# Altium schematic sheet Smart_Bracelet.SchDoc
size A4; SheetNumber: 1; SheetTotal: 3
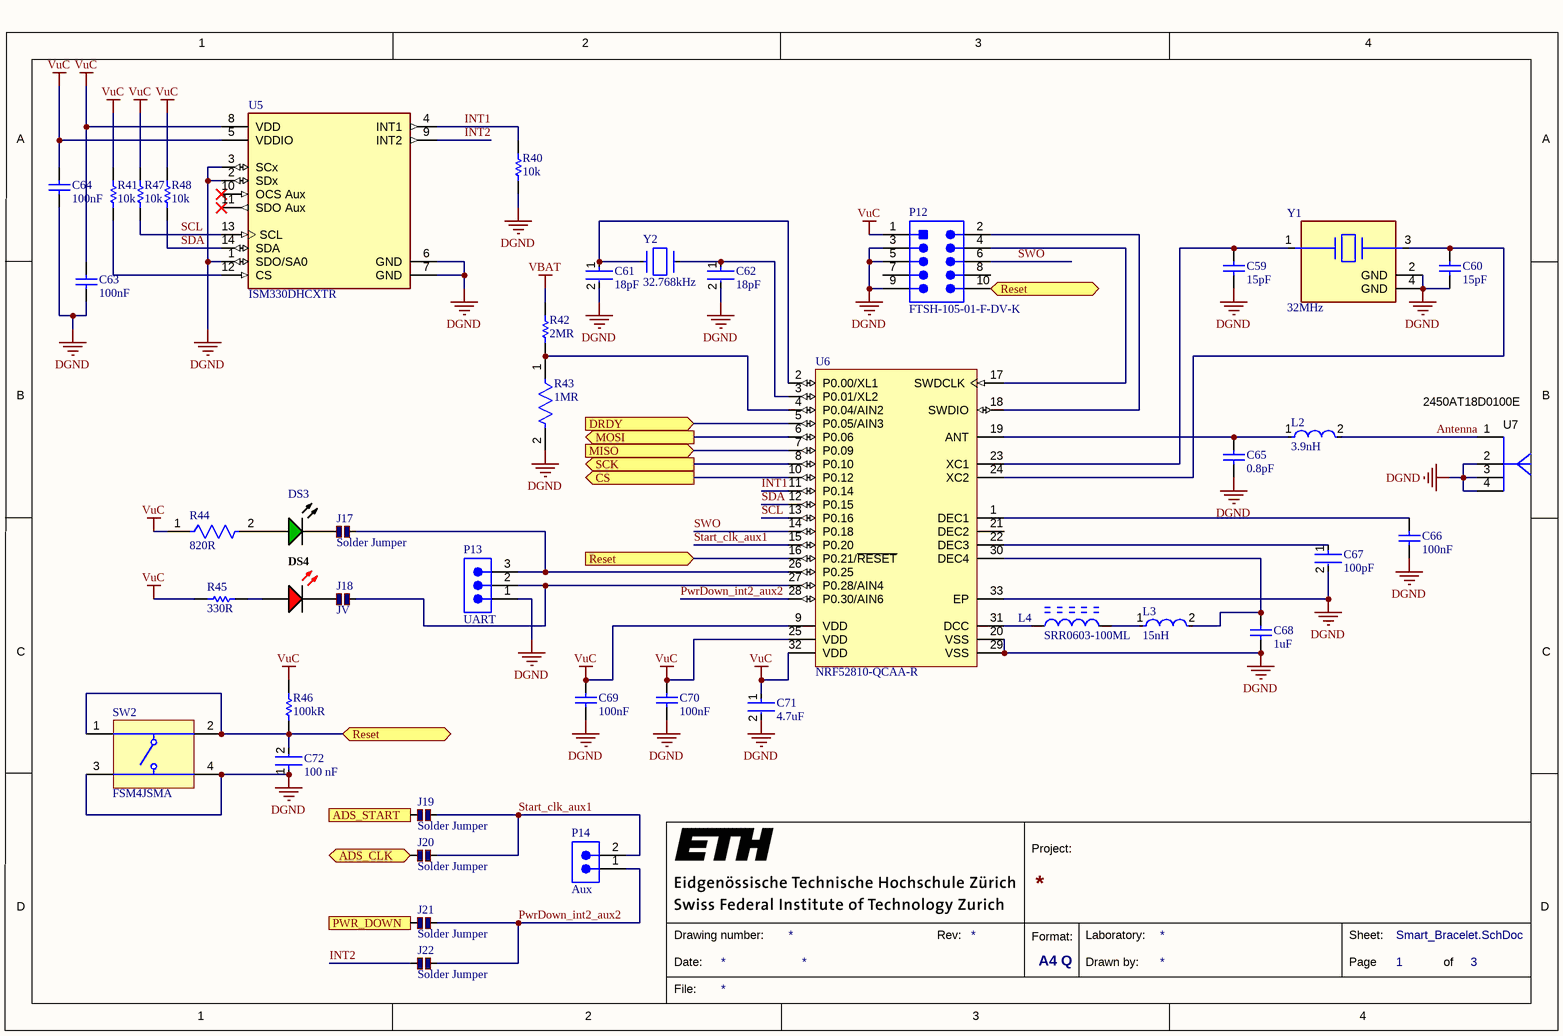
[diagram p0: Smart_Bracelet.SchDoc]

## Parts
C59  15pF  [CAPC1005X55X25ML05T10]
C60  15pF  [CAPC1005X55X25ML05T10]
C61  18pF  [FP-GJM155-0_05-IPC_A]
C62  18pF  [FP-GJM155-0_05-IPC_A]
C63  100nF  [CAPC1005X56X25ML10T15]
C64  100nF  [CAPC1005X56X25ML10T15]
C65  0.8pF  [CAPC1005X55X25ML05T10]
C66  100nF  [CAPC1005X56X25LL10T15]
C67  100pF  [FP-GCM188-0_1-IPC_B]
C68  1uF  [CAPC1608X90X35LL15T15]
C69  100nF  [CAPC1005X56X25LL10T15]
C70  100nF  [CAPC1005X56X25LL10T15]
C71  4.7uF  [FP-CC0603-DA-MFG]
C72  Capacitance: 100 nF  [FP-CC0603-DA-IPC_B]  (hidden comment: CC0603KRX7R9BB104)
DS3  APG1608CGKC/T  [KING-LED0603-25-GREEN_V]  (value not drawn)
DS4  APG1608SURKC/T  [KING-LED0603-25-RED_V]  (value not drawn)
J17  Solder Jumper  [Small Solder Jumper]
J18  JV  [Small Solder Jumper]
J19  Solder Jumper  [Small Solder Jumper]
J20  Solder Jumper  [Small Solder Jumper]
J21  Solder Jumper  [Small Solder Jumper]
J22  Solder Jumper  [Small Solder Jumper]
L2  3.9nH  [FP-LQW15AN_80-MFG]
L3  15nH  [FP-LQW15AN_80-MFG]
L4  SRR0603-100ML  [BOUR-SRR0603_V]
P12  FTSH-105-01-F-DV-K  [SMTC-FTSH-105-01-L-DV-K_V]
P13  UART  [SMTC-TSW-103-07-X-S]
P14  Aux  [SMTC-TSW-102-26-XX-S]
R40  10k  [RESC1609X50X30NL8T20]
R41  10k  [RESC1609X50X30NL8T20]
R42  2MR  [RESC0603(1608)_M]
R43  1MR  [FP-CRCW0603-e3-MFG]
R44  820R  [FP-CRCW0603-e3-IPC_B]
R45  330R  [RESC1608X55X25ML10T15]
R46  100kR  [RESC1608X55X30ML15T15]
R47  10k  [RESC1609X50X30NL8T20]
R48  10k  [RESC1609X50X30NL8T20]
SW2  FSM4JSMA  [TECO-FSM4JSMA_V]
U5  ISM330DHCXTR  [FP-LGA-14L-DM00249496-MFG]
U6  NRF52810-QCAA-R  [NRSC-QFN-32_A_L]
U7  2450AT18D0100E  [JT-2450AT18D0100E_V]
Y1  32MHz  [FP-402-MFG]
Y2  32.768kHz  [FP-ECX-34R-MFG]

## Ports
ADS_CLK (bidir), ADS_START (out), CS (out), DRDY (in), MISO (in), MOSI (out), PWR_DOWN (out), Reset (bidir), Reset (in), SCK (out)

## Nets
DGND: C59.1 C60.1 C61.2 C62.2 C63.2 C64.2 C65.1 C66.1 C67.2 C68.1 C69.1 C70.1 C71.2 C72.1 P12.3 P12.5 P12.9 P13.1 R40.2 R43.2 SW2.3 SW2.4 U5.1(SDO/SA0) U5.2(SDx) U5.3(SCx) U5.6(GND) U5.7(GND) U6.20(VSS) U6.29(VSS) U6.33(EP) U7.2(GND) U7.3(GND) U7.4(GND) Y1.2(GND) Y1.4(GND)
VBAT: R42.2
VuC: C63.1 C64.1 C69.2 C70.2 C71.1 P12.1 R41.1 R44.1 R45.1 R46.2 R47.1 R48.2 U5.5(VDDIO) U5.8(VDD) U6.9(VDD) U6.25(VDD) U6.32(VDD)
ADS_CLK: J20.2 ; port ADS_CLK
ADS_START: J19.2 ; port ADS_START
Antenna: L2.2 U7.1(Feeding_Point)
CS: U6.10(P0.12) ; port CS
DRDY: U6.5(P0.05/AIN3) ; port DRDY
INT1: R40.1 U5.4(INT1) U6.11(P0.14)
INT2: J22.2 U5.9(INT2)
MISO: U6.7(P0.09) ; port MISO
MOSI: U6.6(P0.06) ; port MOSI
PWR_DOWN: J21.2 ; port PWR_DOWN
PwrDown_int2_aux2: J21.1 J22.1 P14.1 U6.28(P0.30/AIN6)
Reset: C72.2 P12.10 R46.1 SW2.1 SW2.2 U6.16(P0.21/~{RESET}) ; port Reset
SCK: U6.8(P0.10) ; port SCK
SCL: R47.2 U5.13(SCL) U6.13(P0.16)
SDA: R48.1 U5.14(SDA) U6.12(P0.15)
Start_clk_aux1: J19.1 J20.1 P14.2 U6.15(P0.20)
SWO: P12.6 U6.14(P0.18)
NetC59_2: C59.2 U6.23(XC1) Y1.1
NetC60_2: C60.2 U6.24(XC2) Y1.3
NetC61_1: C61.1 U6.2(P0.00/XL1) Y2.1(In/Out)
NetC62_1: C62.1 U6.3(P0.01/XL2) Y2.2(Out/In)
NetC65_2: C65.2 L2.1 U6.19(ANT)
NetC66_2: C66.2 U6.1(DEC1)
NetC67_1: C67.1 U6.22(DEC3)
NetC68_2: C68.2 L3.2 U6.30(DEC4)
NetDS3_1: DS3.1(A) R44.2
NetDS3_2: DS3.2(K) J17.2
NetDS4_1: DS4.1(A) R45.2
NetDS4_2: DS4.2(K) J18.2
NetJ17_1: J17.1 P13.3 U6.26(P0.25)
NetJ18_1: J18.1 P13.2 U6.27(P0.28/AIN4)
NetL3_1: L3.1 L4.2
NetL4_1: L4.1 U6.31(DCC)
NetP12_2: P12.2 U6.18(SWDIO)
NetP12_4: P12.4 U6.17(SWDCLK)
NetR41_2: R41.2 U5.12(CS)
NetR42_1: R42.1 R43.1 U6.4(P0.04/AIN2)

Not connected (* = marked no-connect by the designer): P12 7 8; U5 10(OCS_Aux)* 11(SDO_Aux)*; U6 21(DEC2)

## Notes on the sheet
- 1
- 2
- 3
- 4
- A
- B
- C
- Project:
- D
- Date:
- Drawing number:
- Rev:
- Format:
- A4 Q
- Drawn by:
- Laboratory:
- Page
- Sheet:
- of
- File:

## Library data of the parts
C59 C60 = CMP-2008-04265-1: Part Number: GRM1555C1H150GA01D; Manufacturer: Murata
C61 C62 = CMP-2008-03806-2: Multi-Layer Ceramic Capacitor 18pF C0G  ±1% 0402 Paper T/R; Voltage Rating (DC): 50V; Case Code (Imperial): 0402; Radiation Hardening: No; Thickness: 0.022inch; Tolerance: 1%; Packaging: Tape and Reel; Case/Package: 0402; Lead Free: Lead Free; Max Operating Temperature: 125°C; Width: 0.02inch; Height: 0.5mm; Length: 1mm; Package Quantity: 10000; Voltage Rating: 50V; Dielectric: C0G; Termination: SMD/SMT; Depth: 0.5mm; Min Operating Temperature: -55°C; Mount: Surface Mount; Case Code (Metric): 1005; Capacitance: 18pF
C63 C64 C66 C69 C70 = CMP-2008-02880-1: Part Number: 0402ZD104MAT2A; Manufacturer: AVX Interconnect / Elco
C65 = CMP-2008-04116-1: Manufacturer: Murata; Part Number: GRM1555C1ER80BA01D
C67 = CMP-2006-02335-2: Ceramic Capacitor for Automotive 100pF  ±5% 100VDC C0G 0603 Paper T/R; Voltage: 100V; Capacitance: 100pF; Packaging: Tape and Reel; Termination: SMD/SMT; Package Quantity: 1; Height: 0.8mm; Width: 0.8mm; Dielectric: C0G; Mount: Surface Mount; Thickness: 0.035inch; Length: 1.6mm; Depth: 0.8mm; Max Operating Temperature: 125°C; Case Code (Imperial): 0603; Min Operating Temperature: -25°C; Radiation Hardening: No; Voltage Rating: 100V; Case Code (Metric): 1608; Voltage Rating (DC): 100V; Ratings: AEC-Q200; Tolerance: 5%; Lead Free: Lead Free; Case/Package: 0603
C68 = CMP-2006-02241-1: Part Number: C0603C105K9PACTU; Manufacturer: Kemet
C71 = CMP-1035-02782-2: CAP CER 4.7UF 6.3V X5R 0603; Manufacturer: YAGEO; Manufacturer Part Number: CC0603MRX5R5BB475; Tolerance: 0.2; Temperature Coefficient: 15%; Material: Ceramic; Voltage Rating: 6.3 V; Package: CC0603-DA; Voltage: 6.3 V; Temperature Characteristic: X5R; Automotive: No; Temperature: -55°C to +125°C; Temperature Range Low: -55°C; Value: 4.7 uF; Temperature Range High: +125°C; Digikey Description: CAP CER 4.7UF 6.3V X5R 0603; Mouser Description: Multilayer Ceramic Capacitors MLCC - SMD/SMT 4.7uF 6.3V X5R 20%; Device Class L2: Capacitors; Lead Free: Yes; Footprint Url: http://www.yageo.com/exep/pages/download/literatures/UPY-C_GEN_24.pdf; ComponentLink2URL: http://www.yageo.com/documents/recent/UPY-GPHC_X7R_6.3V-to-50V_18.pdf; Height: 0.9mm; Device Class L3: Ceramic Capacitors; ComponentLink2Description: Datasheet; RoHS: TRUE; Device Class L1: Passive Components; Octopart: https://octopart.com/cc0603mrx5r5bb475-yageo-8376541; Category: Cap; Capacitance: 4.7 uF
C72 = CMP-2100-03601-2: CAP CER 0.1UF 50V X7R 0603; Manufacturer: YAGEO; Tolerance: 0.1; Material: Ceramic; Temperature Coefficient: 15%; Value: 100 nF; Voltage Rating: 50 V; Lead Free: Yes; Height: 0.9mm; Voltage: 50 V; Automotive: No; Category: Cap; ComponentLink2Description: Datasheet; ComponentLink2URL: http://www.yageo.com/documents/recent/UPY-GPHC_X7R_6.3V-to-50V_18.pdf; Device Class L1: Passive Components; Device Class L2: Capacitors; Device Class L3: Ceramic Capacitors; Digikey Description: CAP CER 0.1UF 50V X7R 0603; Footprint Url: http://www.yageo.com/exep/pages/download/literatures/UPY-C_GEN_24.pdf; Manufacturer Part Number: CC0603KRX7R9BB104; Mouser Description: Multilayer Ceramic Capacitor, CC Series, 0.1 - F, - 10%, X7R, 50 V, 0603 [1608 Metric]; Octopart: https://octopart.com/cc0603krx7r9bb104-yageo-42244635; Package: CC0603-DA; RoHS: TRUE; Temperature: -55°C to +125°C; Temperature Characteristic: X7R; Temperature Range High: +125°C; Temperature Range Low: -55°C
DS3 = CMP-0239-00001-1: LED, SMT, 0603(1608), 0.25mm Thickness, Green; Forward Current: 30 mA; Reverse Voltage: 5 V; Power Dissipation: 78 mW; Packing: Reel; ComponentLink1Description: Manufacturer URL; ComponentLink1URL: http://www.kingbrightusa.com/; ComponentLink2URL: http://www.kingbrightusa.com/images/catalog/SPEC/APG1608CGKC-T.pdf; Mounting Technology: Surface Mount; Storage Temperature: -40 to 85 degC; DatasheetVersion: Rev. 5B, 10/2012; PartNumber: APG1608CGKC/T; PackageReference: LED0603-25-GREEN; ComponentLink2Description: Datasheet; PackageDescription: 2-Pin SMT LED, 1.6 x 0.8 mm Body, 0.25mm Thickness; PackageVersion: Rev. 5B, 10/2012
DS4 = CMP-0404-00004-1: Ultra Thin Hyper Red SMD Chip LED Lamp, 2 to 2.5 V, -40 to 85 degC, Body 1.6 x 0.8 mm, 0.28 mm Thickness, RoHS, Tape and Reel; Manufacturer: Kingbright; Dice: Hyper Red (AlGaInP); IR (Max): 10 uA; Luminous Intensity mcd @ 20 mA (Min.): 55; Lens Type: Water Clear; Viewing Angle: 120; Luminous Intensity mcd @ 20 mA (Typ.): 110; ComponentLink2Description: Datasheet; ComponentLink3URL: http://www.kingbrightusa.com/images/catalog/SPEC/APG1608SURKC-T.pdf; Packing: Tape and Reel; Mounting Technology: Surface Mount; PackageVersion: Rev. V.5A; ComponentLink1Description: Manufacturer URL; ComponentLink2URL: http://www.kingbrightusa.com/images/catalog/SPEC/APG1608SURKC-T.pdf; ComponentLink3Description: Package Specification; PackageDescription: 2-Pin SMT, Body 1.6 x 0.8 mm, 0.28mm Thickness, Red; PackageReference: LED0603-25-RED; DatasheetVersion: Rev. V.5A; Operating Temperature: -40 to 85 degC; PartNumber: APG1608SURKC/T; ComponentLink1URL: http://www.kingbrightusa.com/; Forward Voltage: 2 to 2.5 V; RoHS: TRUE
J17-J22 = CMP-00005-5: Value: 1; Technology: SMT
L2 = CMP-06042-003836-1: Wire Wound RF Inductor 3.9nH ±0.1nH 1950mA 0.03Ω 0402 (1005); Max DC Current: 1.95A; Self Resonant Frequency: 10GHz; Q Factor: 35; DC Resistance (DCR): 30mR; Test Frequency: 100MHz; Core Material: Ferrite; Shielding: Unshielded; Max Operating Temperature: 125°C; Case Code (Metric): 0402; Packaging: Tape and Reel; Resistor Type: Wirewound; Current Rating: 1.95A; Termination: SMD/SMT; Length: 0.039inch; Case Code (Imperial): 1005; Width: 0.024inch; Case/Package: 0402; Min Operating Temperature: -55°C; Inductance: 3.9nH; Height: 0.5mm; Package Quantity: 10000; Mount: Surface Mount; Height - Seated (Max): 0.024inch
L3 = CMP-06042-004948-1: Wire Wound RF Inductor for Automotive 15nH ±5% 1150mA 0.114Ω 0402 (1005); Shielding: Unshielded; Self Resonant Frequency: 5.5GHz; Current Rating: 1.15A; Core Material: Non-Magnetic; Test Frequency: 100MHz; DC Resistance (DCR): 114mR; Ratings: AEC-Q200; Inductance: 15nH; Min Operating Temperature: -55°C; Tolerance: 5%; Packaging: Cut Tape; Case/Package: 0402; Mount: Surface Mount; Case Code (Metric): 1005; Resistor Type: Wirewound; Max Operating Temperature: 125°C; Case Code (Imperial): 0402
L4 = CMP-2000-07145-1: Shielded Power Inductor, 10 uH, +/- 20%, -40 to 125 degC, 2-Pin SMD, RoHS, Tape and Reel; Manufacturer: Bourns; 3D Model: SRR0603.stp; Inductance: 10µH; Other Names: SRR0603-100MLTR / SRR0603100ML; DC Resistance (DCR): 120mOhmMax; Product Training Modules: MagneticProductOverview; Current - Saturation: 1.5A; PCN Assembly/Origin: MagneticproductsOct/2013; Frequency - Test: 1kHz; Material - Core: Ferrite; Online Catalog: SRRSeries; Current Rating: 1.1A; Frequency - Self Resonant: 25MHz; EDA / CAD Models: DownloadfromAcceleratedDesigns; Q @ Freq: 16@2.52MHz; Type: Wirewound; Manufacturer URL: http://www.bourns.com/; Mounting Technology: SurfaceMount; Datasheet URL: http://www.bourns.com/docs/Product-Datasheets/SRR0603.pdf; Standard Package: 1,000; Package Description: 2-Pin Surface Mount Device, Body 6.5 x 6.5 mm; RoHS Information: SRR0603SeriesMaterialDeclaration; Category: Inductors,Coils,Chokes; Package / Case: Nonstandard; Operating Temperature: -40°C~125°C; Series: SRR0603; Tolerance: ±20%; Height - Seated (Max): 0.130"(3.30mm); Packaging: Tape&Reel(TR); Shielding: Shielded; Family: FixedInductors; Package Reference: SRR00603; Size / Dimension: 0.256"Lx0.256"W(6.50mmx6.50mm); Datasheet Version: 09/2011; Mounting Type: SurfaceMount
P12 = CMP-2000-05352-1: Male Header, Pitch 1.27 mm, 2 x 5 Position, Height 6.12 mm, RoHS, Tube; Manufacturer: Samtec; Number of Positions: 10; Connector Type: Header,Shrouded; Number of Positions Loaded: All; Row Spacing: 0.050"(1.27mm); Fastening Type: -; Package Reference: FTSH-105-01-L-DV-K; Termination: Solder; Package URL: http://suddendocs.samtec.com/prints/ftsh-1xx-xx-xxx-dv-xxx-footprint.pdf; Number of Rows: 2; Contact Finish Thickness: 3µin(0.08µm); Contact Type: MalePin; Manufacturer URL: http://www.samtec.com/; Contact Mating Length: 0.120"(3.05mm); Pitch: 0.050"(1.27mm); Series: FTSH; Features: -; Contact Finish: Gold; Color: Black; Family: RectangularConnectors-Headers,MalePins; Datasheet URL: http://suddendocs.samtec.com/prints/ftsh-1xx-xx-xxx-dv-xxx-mkt.pdf; Package Description: Male Header, Pitch 1.27 mm, 2 x 5 Position, Height 5.97 mm, Tail Length 4.32 mm; Mounting Type: SurfaceMount; Datasheet Version: Rev. ET, 10/1995; Category: Connectors,Interconnects; Packaging: Tube
P13 = CMP-1024-00332-1: 0.025" SQ Post Header, Through-hole, Vertical, -55 to 105 degC, 2.54 mm Pitch, 3-Pin, Male, RoHS; PartNumber: TSW-103-07-T-S; Manufacturer: Samtec; Pitch: 2.54 mm; ComponentLink1URL: http://www.samtec.com; ComponentLink3URL: http://www.samtec.com/documents/webfiles/cpdf/TSW-XXX-XX-XXX-X-XX-XXX-MKT.pdf; Mounting Technology: Through-hole; RoHS: True; DatasheetVersion: F-214; PackageVersion: DM, 8/1988; Temperature Range: -55 to 105 degC; ComponentLink2Description: Datasheet; ComponentLink1Description: Manufacturer URL; Orientation: Vertical; PackageReference: TSW-103-07-X-S; ComponentLink3Description: Package Specification; ComponentLink2URL: http://www.samtec.com/documents/webfiles/pdf/TSW_TH.PDF; PackageDescription: .025[0.64] SQ. Post Terminal Strip Assembly
P14 = CMP-1024-00327-1: 0.025" SQ Post Header, Through-hole, Vertical, -55 to 125 degC, 2.54 mm Pitch, 2-Pin, Male, RoHS; PartNumber: TSW-102-26-G-S; Manufacturer: Samtec; Pitch: 2.54 mm; Orientation: Vertical; ComponentLink3Description: Package Specification; PackageReference: TSW-102-26-XX-S; Mounting Technology: Through-hole; ComponentLink2Description: Datasheet; ComponentLink1URL: http://www.samtec.com; DatasheetVersion: F-214; ComponentLink1Description: Manufacturer URL; RoHS: True; ComponentLink2URL: http://www.samtec.com/documents/webfiles/pdf/TSW_TH.PDF; ComponentLink3URL: http://www.samtec.com/documents/webfiles/cpdf/TSW-XXX-XX-XXX-X-XX-XXX-MKT.pdf; PackageDescription: .025[0.64] SQ. Post Terminal Strip Assembly; PackageVersion: DM, 8/1988; Temperature Range: -55 to 125 degC
R40 R41 R47 R48 = CMP-1666-00005-4: Chip Resistor, 10 KOhm, +/- 1%, 100 mW, -55 to 155 degC, 0603 (1608 Metric), RoHS, Tape and Reel; Manufacturer: Vishay Semiconductor; Voltage Rating: 75 V; Max Operating Temperature: 155 degC; PackageDescription: 2-Pin Surface Mount Device, Body 1.575 x 0.85 mm; ComponentLink1Description: Manufacturer URL; RoHSCompliant: true; PackageReference: 0603; REACH SVHC: Unknown; Length: 1.55 mm; DatasheetVersion: 06/2012; Packaging: Tape and Reel; Min Operating Temperature: -55 degC; Mounting Technology: Surface Mount; ComponentLink2URL: https://datasheet.ciiva.com/11809/0900766b80d98afc-11809037.pdf; Height: 0.45 mm; ComponentLink2Description: Datasheet; Package Quantity: 5000; ComponentLink1URL: http://www.vishay.com/
R42 = CMP-1012-00881-1: 2M 0.1W 1% 0603 (1608 Metric)  SMD; Case-Metric: 1608; Case-EIA: 0603; Value: 2000000.00 Ohm; Tolerance: 1 %; Power: 0.1 W; Technology: SMT
R43 = CMP-2000-03013-2: RES Thick Film, 1MΩ, 1%, 0.1W, 100ppm/°C, 0603; Max Power Dissipation: 100mW; Voltage Rating (DC): 75V; Depth: 0.85mm; Max Operating Temperature: 155°C; Length: 1.55mm; Power Rating: 100mW; Military Standard: Not; Resistance: 1MR; Features: Automotive AEC-Q200; Min Operating Temperature: -55°C; Number of Pins: 2; Mount: Surface Mount; Package Quantity: 10; Packaging: Tape and Reel; Height: 0.45mm; Radiation Hardening: No; Case Code (Metric): 1608; Temperature Coefficient: 100ppm/°C; Width: 0.85mm; Composition: Thick Film; Termination: SMD/SMT; Tolerance: 1%; Number of Terminations: 2; Lead Free: Lead Free; Contact Plating: Tin; Case/Package: 0603; Weight: 7.1E-05oz; Voltage Rating: 75V; Case Code (Imperial): 0603
R44 = CMP-2000-03598-2: RES Thick Film, 820Ω, 1%, 0.1W, 100ppm/°C, 0603; Max Power Dissipation: 100mW; Voltage Rating: 75V; Termination: SMD/SMT; Depth: 0.85mm; Radiation Hardening: No; Lead Free: Lead Free; Package Quantity: 10; Max Operating Temperature: 155°C; Power Rating: 100mW; Height: 0.45mm; Case Code (Metric): 1608; Case Code (Imperial): 0603; Case/Package: 0603; Mount: Surface Mount; Features: Automotive AEC-Q200; Composition: Thick Film; Weight: 7.1E-05oz; Contact Plating: Tin; Width: 0.033inch; Number of Terminations: 2; Tolerance: 1%; Packaging: Tape and Reel; Voltage Rating (DC): 75V; Length: 1.55mm; Resistance: 820R; Min Operating Temperature: -55°C; Military Standard: Not; Temperature Coefficient: 100ppm/°C
R45 = CMP-1659-00020-2: Chip Resistor, 330 Ohm, +/- 1%, 0.1 W, -55 to 155 degC, 0603 (1608 Metric), RoHS, Tape and Reel; Tolerance: 10%; ESR: 800 mohm; Voltage Rating (DC): 16 V; Capacitance: 47 uF; Length: 7.3 mm; ComponentLink1URL: http://www.yageo.com/; Packaging: Tape and Reel; Pins: 2; ComponentLink1Description: Manufacturer URL; Case Code (Imperial): 2917; REACH SVHC: No SVHC; Width: 4.3 mm; ComponentLink2Description: Datasheet; Voltage Rating: 16 V; RoHSCompliant: True; Max Operating Temperature: 125degC; ComponentLink2URL: http://www.yageo.com/documents/recent/PYu-RC_Group_51_RoHS_L_04.pdf; Min Operating Temperature: -55degC; Case/Package: 2917; Radiation Hardening: No; DatasheetVersion: Rev. 4, 02/2016; Mount: Surface Mount; PackageReference: 0603; Package Quantity: 500; Case Code (Metric): 7343; PackageDescription: 2-Pin Surface Mount Device, Body 1.6 x 0.8 mm; Height: 3.1 mm
R46 = CMP-2000-00705-1: Manufacturer: Panasonic; Part Number: ERJ-3GEYJ104V
SW2 = CMP-2000-05602-2: Swicth, SPST, 24 V, -35 to 85 degC, 4-Pin SMD, RoHS, Tape and Reel; Manufacturer: TE Connectivity; Switch Travel: 0.25mm; Mechanical Life: 100000Cycles; Contact Current Rating: 50mA; Operating Force: 1.57N; Actuator Material: Polyamide; Contact Resistance: 100mOhm; Voltage Rating: 24V; Illumination Type: Illuminated; Actuator Length: 0.055inch; Max Voltage Rating (DC): 12V; Case\/Package: SMD/SMT; Orientation: Straight; Datasheet URL: http://www.te.com/commerce/DocumentDelivery/DDEController?Action=showdoc&DocId=Customer+Drawing%7F2-1437565-7%7FV%7Fpdf%7FEnglish%7FENG_CD_2-1437565-7_V.pdf%7F4-1437565-2; Min Operating Temperature: -35degC; Packaging: LoosePiece; Termination: GullWing; Throw Configuration: SPST; Package Description: 4-Pin Surface Mount Device, Body 6 x 6 mm, Pitch 4.5 mm; Mounting Technology: SurfaceMount; Contact Plating: Silver; Datasheet Version: Rev. V, 02/2015; RoHSCompliant: true; Max Operating Temperature: 85degC; Length: 6mm; Voltage Rating (DC): 24V; Electrical Life: 100000Cycles; Current Rating: 50mA; Package Quantity: 750; Mount: SurfaceMount; Package Reference: FSM4JSMA; Manufacturer URL: http://www.te.com/; Width: 6mm; REACH SVHC: Unknown; Contact Material: CopperAlloy
U5 = CMP-12177-000014-1: INEMO INERTIAL MODULE: ALWAYS-ON
U6 = CMP-2000-07522-1: High performance, entry-level Bluetooth 5/ANT/2.4GHz SoC, 1.7 to 3.6 V, -40 to 85 degC, 32-Pin QFN, RoHS, Tape and Reel; Manufacturer: Nordic Semiconductor; Datasheet URL: http://infocenter.nordicsemi.com/pdf/nRF52810_PS_v1.0.pdf; Datasheet Version: Rev. 1.0, 09/2017; RoHSCompliant: false; Package Description: 32-Pin Quad Flat No-lead Package, Body 5 x 5 mm, Pitch 0.5 mm; Manufacturer URL: http://www.nordicsemi.com/eng/Products/; Package Reference: QFN-32; Mounting Technology: SurfaceMount
U7 = CMP-2000-05543-1: Chip RF Antenna, 2.4 to 2.5 GHz, -40 to 125 degC, 4-Pin SMD, RoHS, Tape and Reel; Manufacturer: Johanson Technology; Number of Bands: 1; Gain: 1.5dBi; Return Loss: -10dB; Power - Max: 2W; Frequency Group: UHF(2GHz~3GHz); Online Catalog: JohansonTechnologyInc-Embedded; Frequency (Center/Band): 2.4GHz; Other Names: 712-1573-2; Frequency Range: 2.4GHz~2.5GHz; Series: -; Antenna Type: Chip; Features: -; Applications: -; Category: RF/IFandRFID; Height (Max): 0.047"(1.20mm); Standard Package: 3,000; Package Reference: 2450AT18D0100E; Package Description: 4-Pin Surface Mount Device, Body 3.2 x 1.6 mm; Datasheet Version: Rev. 3.0, 09/2015; Manufacturer URL: https://www.johansontechnology.com/; Datasheet URL: http://www.johansontechnology.com/datasheets/antennas/2450AT18D0100.pdf; Mounting Type: SurfaceMount; Termination: Solder; VSWR: -; Mounting Technology: SurfaceMount; Ingress Protection: -; Family: RFAntennas; Packaging: Tape&Reel(TR)
Y1 = CMP-06858-000005-1: CRYSTAL 32.0000MHZ 10PF SMD; Frequency Tolerance: 10ppm; Series Resistance: 100R; Width: 0.063inch; Height: 0.022inch; Length: 0.079inch; Frequency: 32MHz; Contact Plating: Gold; Package Quantity: 3000; Case/Package: SMD/SMT; Frequency Stability: 10ppm; ESR (Equivalent Series Resistance): 100R; Min Operating Temperature: -20°C; Tolerance: 10ppm; Load Capacitance: 10pF; Packaging: Tape and Reel; Max Operating Temperature: 70°C; Mount: Surface Mount; Termination: SMD/SMT
Y2 = CMP-40224-000012-1: CRYSTAL 32.768KHZ 7PF SMD; Manufacturer Part Number: ECS-.327-7-34R-TR; Manufacturer: ECS Inc.; Tolerance: 20ppm; Esr: 50kΩ; Temperature Range Low: -40°C; Package: ECX-34R; Category: Crys; Load Capacitance: 7pF; Device Class L1: Passive Components; ComponentLink2Description: Datasheet; RoHS: TRUE; Octopart: https://octopart.com/ecs-.327-7-34r-tr-ecs+international-71119730; Temperature: -40°C to +85°C; Series: ECX-34R; Device Class L3: Crystals; Height: 0.9mm; ComponentLink2URL: http://www.ecsxtal.com/store/pdf/ECX_34R.pdf; Device Class L2: Crystals / Oscillators; Lead Free: Yes; Temperature Range High: +85°C; Mouser Description: Crystals 32.768kHz 7pF 20ppm; Frequency: 32.768kHz; Automotive: No; Digikey Description: CRYSTAL 32.768KHZ 7PF SMD